# EAGLE schematic PW Connector (EAGLE 8.3.2)
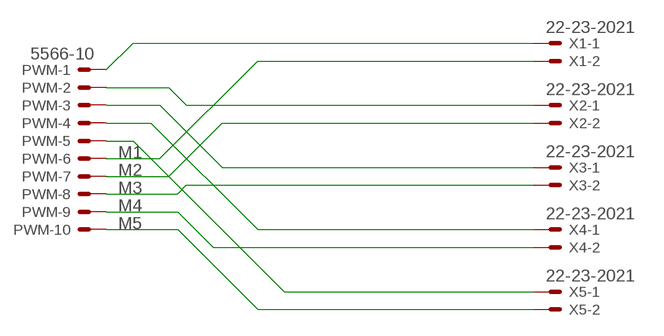
[diagram p0: schematic, sheet 1]

## Parts
PWM  5566-10  [5566-10]
X1  22-23-2021  [22-23-2021]
X2  22-23-2021  [22-23-2021]
X3  22-23-2021  [22-23-2021]
X4  22-23-2021  [22-23-2021]
X5  22-23-2021  [22-23-2021]

## Nets
M1: PWM.6 X1.2
M2: PWM.7 X2.2
M3: PWM.8 X3.2
M4: PWM.9 X4.2
M5: PWM.10 X5.2
N$1: PWM.1 X1.1
N$2: PWM.2 X2.1
N$3: PWM.3 X3.1
N$4: PWM.4 X4.1
N$5: PWM.5 X5.1

## Library data of the parts
PWM = con-molex:5566-10: Mini FIT connector 10 pol Source: http://www.molex.com; OC_FARNELL: unknown; OC_NEWARK: unknown
X1-X5 = con-molex:22-23-2021: .100" (2.54mm) Center Header - 2 Pin; MF: MOLEX; MPN: 22-23-2021; OC_FARNELL: 1462926; OC_NEWARK: 25C3832